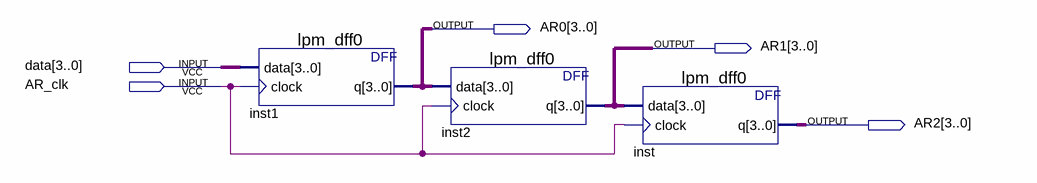
[diagram p0: schematic sheet]
// Quartus schematic AddressRegister.bdf as structural Verilog: 3 symbols, 5 pins
module AddressRegister (
  input  [3:0] data,
  input  AR_clk,
  output [3:0] AR0,
  output [3:0] AR1,
  output [3:0] AR2
);

  lpm_dff0 inst1 (.data(data), .clock(AR_clk), .q(AR0));
  lpm_dff0 inst2 (.data(AR0), .clock(AR_clk), .q(AR1));
  lpm_dff0 inst (.data(AR1), .clock(AR_clk), .q(AR2));
endmodule
